# EAGLE design weblight_developer (EAGLE 7.5.0)
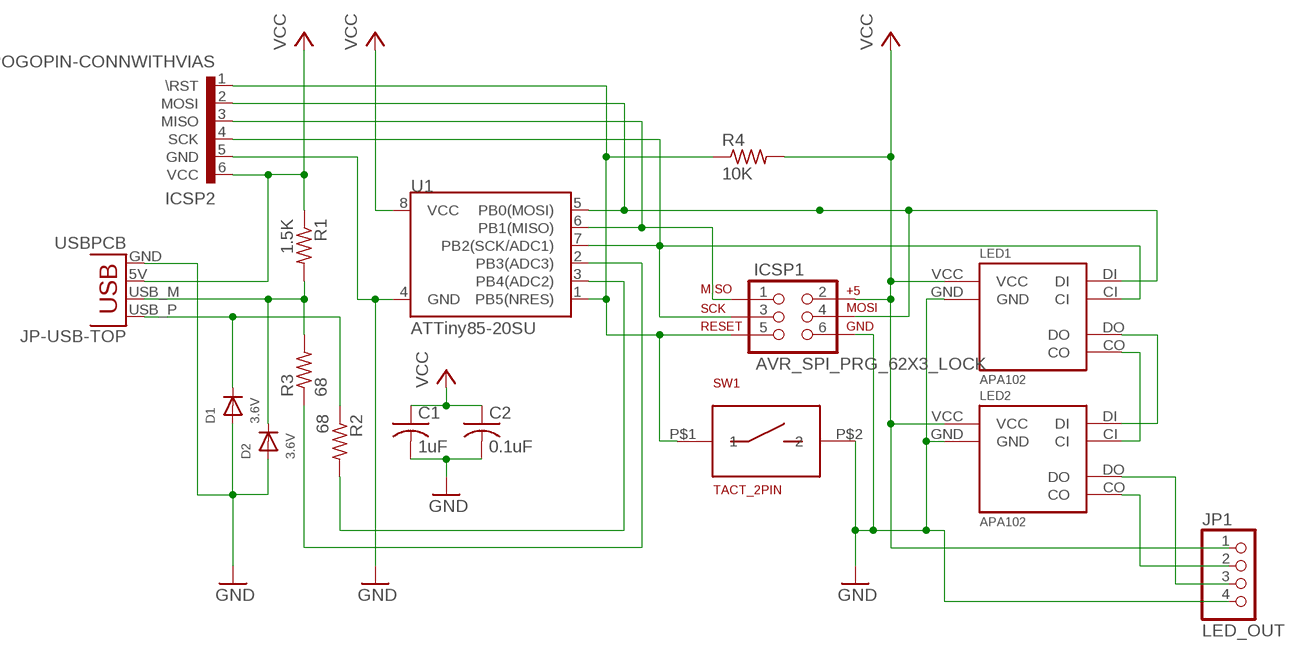
[diagram p0: schematic, sheet 1]

## Parts
C1  1uF  C-USC0805  [C0805]
C2  0.1uF  C-USC0805  [C0805]
D1  3.6V  DIODESOD-323  [SOD-323]
D2  3.6V  DIODESOD-323  [SOD-323]
ICSP1  AVR_SPI_PRG_62X3_LOCK  [2X3_LOCK]
ICSP2  POGOPIN-CONNWITHVIAS  [POGOPROG-CONN-0H]
JP1  LED_OUT  HEADER-1X4ROUND  [1X04_ROUND]
JP-USB-TOP  USBPCB  [USB-A-PCB]
LED1  APA102  [APA102]
LED2  APA102  [APA102]
R1  1.5K  R-US_R0805  [R0805]
R2  68  R-US_R0805  [R0805]
R3  68  R-US_R0805  [R0805]
R4  10K  R-US_R0805  [R0805]
SW1  TACT_2PIN  [TD-85XU]
U1  ATTiny85-20SU  ATTINY45TINY85-20-SMT  [SO08-EIAJ]

## Nets
CLK_1/SCK: ICSP1.3 ICSP2.4(SCK) LED1.CI U1.7(PB2(SCK/ADC1))
CLK_2: LED1.CO LED2.CI
CLK_3: JP1.2 LED2.CO
DATA_1/MOSI: ICSP1.4 ICSP2.2(MOSI) LED1.DI U1.5(PB0(MOSI))
DATA_2: LED1.DO LED2.DI
DATA_3: JP1.3 LED2.DO
GND: C1.2 C2.2 D1.A D2.A ICSP1.6 ICSP2.5(GND) JP1.4 JP-USB-TOP.GND LED1.GND LED2.GND SW1.P$2 U1.4(GND)
MISO: ICSP1.1 ICSP2.3(MISO) U1.6(PB1(MISO))
N_RESET: ICSP1.5 ICSP2.1(\RST) R4.1 SW1.P$1 U1.1(PB5(NRES))
USB_D_MINUS: R3.1 U1.2(PB3(ADC3))
USB_D_MINUS_RAW: D2.C JP-USB-TOP.USB_M(D-) R1.2 R3.2
USB_D_PLUS: R2.2 U1.3(PB4(ADC2))
USB_D_PLUS_RAW: D1.C JP-USB-TOP.USB_P(D+) R2.1
VCC: C1.1 C2.1 ICSP1.2 ICSP2.6(VCC) JP1.1 JP-USB-TOP.5V(VBUS) LED1.VCC LED2.VCC R1.1 R4.2 U1.8(VCC)

## Library data of the parts
C1 C2 = rcl:C-US: CAPACITOR, American symbol
D1 D2 = microbuilder:DIODE: Diode SMA Model Volts Amps Type Vf Vr Digikey # Notes SSA34-E3 40V 3A Schottky 480mV @ 3A 200uA @ 40V SSA34-E3/61TGITR-ND CDBA120-G 20V 1A Schottky 500mV @ 1A 500uA @ 20V 641-1014-6-ND REEL MBRA210 10V 2A Schottky 350mV @ 2A 700uA @ 10V MBRA210LT3 SOD-123 Model Volts Amps Type Vf Vr Order # Notes BAT54T1G 30V 200mA Schottky 800mV @ 200mA 2uA @ 25V BAT54T1GOSTR-ND B0530W 30V 500mA Schottky 430mV @ 500mA 130uA @ 30V B0530W-FDICT-ND REEL MBR120 1A 20V Schottky 340mV @ 1A MBR120VLSFT1GOSCT-ND SOD-323 Model Volts Amps Type Vf Vr Order # Notes PMEG2005EJ 20V 500mA Schottky 355mV @ 500mA 568-4110-1-ND ZLLS410 10V 570mA Schottky 380mV @ 570mA ZLLS410CT-ND 1N4148WS 75V 150mA Silicon/Simple 1V 1N4148WSFSCT-ND REEL SOD-523 Model Volts Amps Type Vf Vr Order # Notes BAT54XV2 30V 200mA Schottky 0.8V @ 100mA BAT54XV2CT-ND TB751S 30V 30mA Schottky RB751S-40TE61CT-ND SOT23-R/W (R = Solder Paste/Reflow Ovens, W = Hand-Soldering) Model Volts Amps Type Vf Vr Order # Notes BAT54FILM 40V 300mA Schottky 497-7162-1-ND
ICSP1 = SparkFun-Connectors:AVR_SPI_PRG_6: AVR ISP 6 Pin This is the reduced ISP connector for AVR programming. Common on Arduino. This footprint will take up less PCB space and can be used with a 10-pin to 6-pin adapter such as SKU: BOB-08508 **Special note about "TEST_POINT" package. The stop mask is on the top side, so if you want your programming test points to be on the bottom of your board, make sure to place this package on the bottom side of the board. This also ensure that the orientation to program from the bottom side will be correct.
ICSP2 = weblight:POGOPIN-CONN: Protofusion custom pogo pin programming header
JP1 = microbuilder:HEADER-1X4: PIN HEADER
JP-USB-TOP = SparkFun-Connectors:USB: USB Connectors USB-B-PTH is fully proven SKU : PRT-00139/CONN-08278 USB-miniB is fully proven SKU : PRT-00587 USB-A-PCB is untested. USB-A-H is throughly reviewed, but untested. Spark Fun Electronics SKU : PRT-00437 USB-B-SMT is throughly reviewed, but untested. Needs silkscreen touching up. USB-A-S has not been used/tested USB-MB-H has not been used/tested USB-MICROB has been used. CONN-09505
LED1 LED2 = weblight:APA102
R1-R4 = rcl:R-US_: RESISTOR, American symbol
SW1 = weblight:TACT_2PIN
U1 = SparkFun-DigitalIC:ATTINY45: Atmel 8-pin 2/4/8kB flash uC; PROD_ID: IC-09092; VALUE: Tiny85-20-SMT

## Board
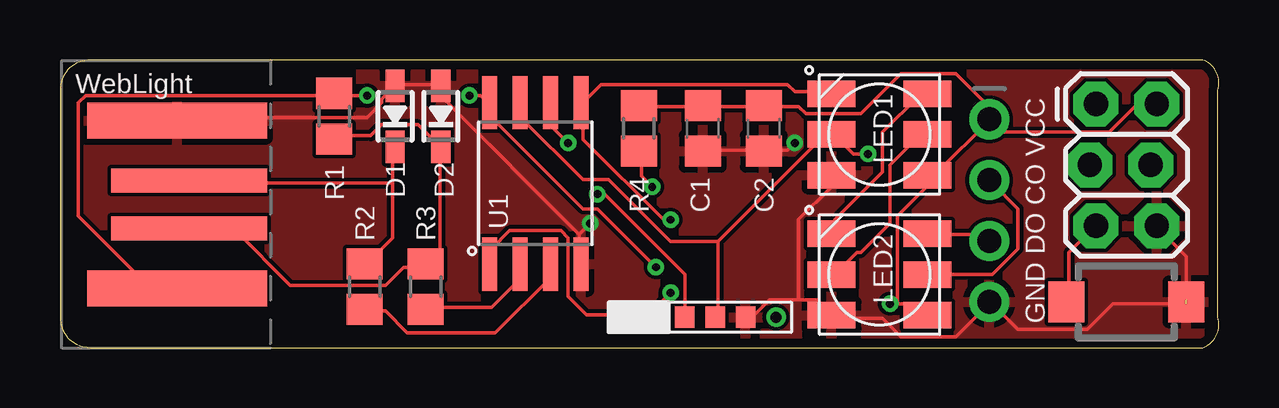
[diagram p1: board, top side]
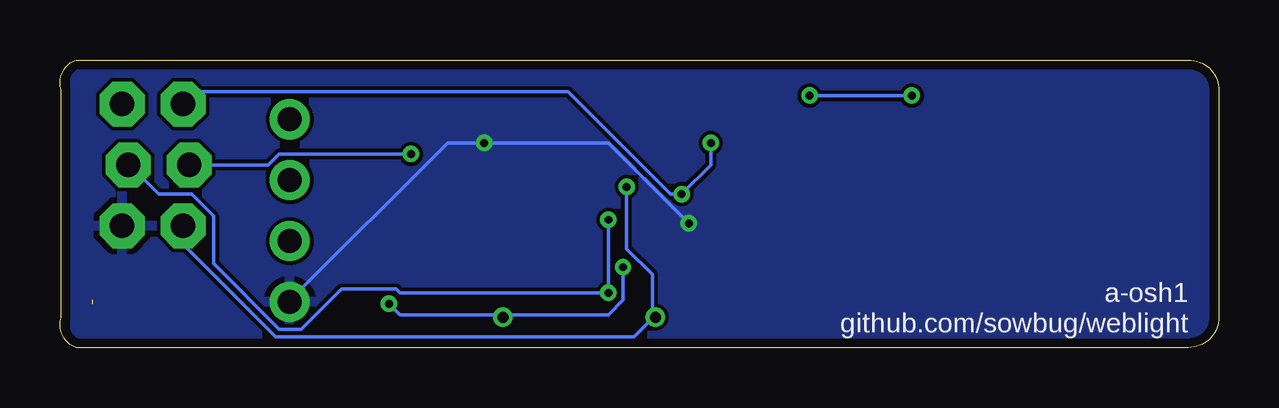
[diagram p2: board, bottom side, seen from below]

Size 48.31 x 12 mm. Coordinates in mm from the lower left corner, seen from the top.
Outline: 0,10.73 0,1.27 arc90 1.27,0 47.62,0 arc90 48.26,1.27 48.26,10.73 arc90 47.62,12 1.27,12 arc90 0,10.73
Copper layers (1*16): Top 0.0356mm / dielectric 1.5011mm / Bottom 0.0356mm
Design rules "LaenPCBOrder": minimum track width 6mil, minimum drill 13mil, track to track 6mil, track to pad 6mil, pad to pad 6mil, via to via 6mil, smd to smd 6mil, copper to edge 15mil, drill to drill 6mil, minimum pad ring 7mil, minimum via ring 7mil, stop-mask expansion 3mil, vias tented up to drill 0mil, thermal gap 10mil
vRestrict: area 0,0 to 9.5,12.1; area 1.3,0.6 to 19.1,2.5

### Footprints (pad centres in the part's own frame; a part is rotated, then mirrored left to right if it is on the bottom)
C0805 = smd 1.3 x 1.5: 1 -0.95,0; 2 0.95,0
SOD-323 = smd 1.35 x 0.8: A 1.27,0; C -1.27,0
2X3_LOCK = drill 1.016 pad 1.88 octagon: 1 0,0; 2 0,2.54; 3 2.54,-0.254; 4 2.54,2.286; 5 5.08,0; 6 5.08,2.54
POGOPROG-CONN-0H = drill 0.457: 1 0,3.81; 6 0,-2.54 | smd 0.889 x 0.813: 2 0,2.54; 3 0,1.27; 4 0,0; 5 0,-1.27
1X04_ROUND = drill 1 pad 1.676: 1 -3.81,0; 2 -1.27,0; 3 1.27,0; 4 3.81,0
USB-A-PCB = smd 7.5 x 1.5: 5V -0.2,-3.5; GND -0.2,3.5 | smd 6.5 x 1: USB_M 0.3,-1; USB_P 0.3,1
APA102 = smd 2 x 1.1: CI 2,0; CO -2,0; DI 2,-1.7; DO -2,-1.7; GND 2,1.7; VCC -2,1.7
R0805 = smd 1.3 x 1.5: 1 -0.95,0; 2 0.95,0
TD-85XU = smd 1.5 x 1.7: P$1 -2.5,0; P$2 2.5,0
SO08-EIAJ = smd 0.61 x 2.21: 1 -1.905,-3.378; 2 -0.635,-3.378; 3 0.635,-3.378; 4 1.905,-3.378; 5 1.905,3.353; 6 0.635,3.353; 7 -0.635,3.353; 8 -1.905,3.353

### Placement (x,y rotation side)
C1  26.8,9.14 270 top
C2  29.34,9.14 270 top
D1  13.97,9.65 90 top
D2  15.88,9.65 90 top
ICSP1  43.18,10.16 270 top
ICSP2  27.3,1.27 90 top
JP1  38.73,5.71 270 top
JP-USB-TOP  5.08,5.97 0 top
LED1  34.16,8.89 180 top
LED2  34.16,3.05 180 top
R1  11.43,9.65 270 top
R2  12.7,2.54 270 top
R3  15.24,2.54 90 top
R4  24.13,9.14 90 top
SW1  44.45,1.91 0 top
U1  19.81,6.86 0 top

### Tracks (layer width: path | path; a pad name or v marks a point on that pad's centre or on a via)
CLK_1/SCK  (via drill 0.33)
  Top 0.152: 27.43,4.42 27.43,1.37 ICSP2.4 | 27.43,4.42 31.85,8.84 32.16,8.84 LED1.CI 32.31,8.84 33.07,8.08 v33.68,8.08 | 27.43,4.42 25.45,4.42 22.86,7.01 21.79,7.01 19.2,9.6 19.2,10.21 U1.7
  Bottom 0.152: v33.68,8.08 39.17,8.08 39.62,7.62 42.82,7.62 ICSP1.3
CLK_2
  Top 0.152: LED2.CI 32.31,3.05 33.22,3.96 33.38,3.96 34.59,5.18 34.59,7.62 35.81,8.84 36.12,8.84 LED1.CO
CLK_3
  Top 0.152: LED2.CO 36.27,3.05 38.86,3.05 39.93,4.12 39.93,5.79 38.86,6.86 JP1.2
DATA_1/MOSI  (via drill 0.33)
  Top 0.152: 21.79,10.21 22.55,10.97 30.33,10.97 30.63,10.67 32.16,10.67 LED1.DI | 21.79,10.21 U1.5 21.79,10.21 | v25.45,2.29 24.84,1.68 24.84,1.37 ICSP2.2 | 21.79,10.21 21.79,8.69 25.15,5.33 v25.45,5.33
  Bottom 0.152: ICSP1.4 45.41,7.62 44.2,6.4 42.82,6.4 41.91,5.49 41.91,3.5 39.17,0.76 38.25,0.76 36.58,2.44 34.29,2.44 34.14,2.29 v25.45,2.29 v25.45,5.33
DATA_2
  Top 0.152: LED2.DI 32.31,4.88 32.31,5.33 34.29,7.32 34.29,8.99 35.81,10.52 36.12,10.52 LED1.DO
DATA_3
  Top 0.152: LED2.DO 36.27,4.72 38.56,4.72 38.71,4.57 JP1.3
GND  (via drill 0.33)  (2 unrouted)
  Top 0.152: 30.79,1.98 31.55,1.98 32.16,1.37 LED2.GND 32.31,1.22 34.29,1.22 35.05,0.46 37.34,0.46 38.71,1.83 JP1.4 38.86,1.83 39.93,0.76 42.82,0.76 43.89,1.83 46.94,1.83 | 30.79,1.98 29.57,1.98 28.96,1.37 28.65,1.37 ICSP2.5 | 30.79,1.98 30.79,5.33 32.16,6.71 32.16,7.16 LED1.GND | 46.94,1.98 46.94,3.81 45.72,5.03 ICSP1.6 | C1.2 26.82,8.23 29.26,8.23 C2.2 29.41,8.23 30.33,8.23 v30.63,8.53 | JP-USB-TOP.GND 5.03,9.6 12.8,9.6 13.41,10.21 13.41,10.36 13.87,10.82 D1.A 14.02,10.97 15.85,10.97 D2.A 16,10.82 16,10.36 21.64,4.72 | 21.64,4.72 21.64,3.5 U1.4 | 21.64,4.72 v22.1,5.18
  Bottom 0.152: JP1.4 38.71,1.98 32.16,8.53 v30.63,8.53 25.45,8.53 v22.1,5.18
  pour Bottom: -1.27,13.34 49.53,13.34 49.53,-1.27 -1.27,-1.27
  pour Top: -0.64,12.7 48.9,12.7 48.9,-0.64 -0.64,-0.64
MISO  (via drill 0.33)
  Top 0.152: v22.4,6.4 22.71,6.4 26.06,3.05 26.06,1.37 ICSP2.3 | v21.18,8.53 20.57,9.14 20.57,10.21 U1.6
  Bottom 0.152: ICSP1.1 43.13,10.21 42.67,10.67 27.13,10.67 22.86,6.4 v22.4,6.4 21.18,7.62 v21.18,8.53
N_RESET  (via drill 0.33)
  Top 0.152: SW1.P$1 42.06,1.98 42.06,3.96 43.13,5.03 ICSP1.5 | v24.69,6.71 24.23,7.16 24.23,8.08 R4.1 | U1.1 17.98,3.5 17.98,4.12 18.75,4.88 20.88,4.88 21.18,4.57 21.18,2.13 21.95,1.37 23.47,1.37 ICSP2.1
  Bottom 0.152: v24.69,6.71 24.69,4.12 23.62,3.05 23.62,1.37 ICSP2.1 23.62,1.22 24.38,0.46 39.32,0.46 43.13,4.27 43.13,5.03 ICSP1.5
USB_D_MINUS
  Top 0.152: R3.1 15.24,1.68 17.98,1.68 19.05,2.74 19.05,3.35 U1.2
USB_D_MINUS_RAW
  Top 0.152: 15.85,8.38 15.85,4.12 15.24,3.5 R3.2 15.24,3.35 14.33,3.35 13.56,2.59 9.6,2.59 7.32,4.88 5.49,4.88 JP-USB-TOP.USB_M | 15.85,8.38 D2.C 15.85,8.38 | 15.85,8.38 14.94,9.3 13.41,9.3 12.95,8.84 11.43,8.84 R1.2
USB_D_PLUS
  Top 0.152: R2.2 12.8,1.52 13.56,1.52 14.48,0.61 18.14,0.61 20.42,2.9 20.42,3.35 U1.3
USB_D_PLUS_RAW
  Top 0.152: 13.87,6.86 13.87,4.57 12.8,3.5 R2.1 | 13.87,6.86 13.87,8.38 D1.C | 13.87,6.86 5.49,6.86 JP-USB-TOP.USB_P
VCC  (via drill 0.33)
  Top 0.152: R4.2 24.23,10.06 26.67,10.06 C1.1 26.82,10.06 29.26,10.06 C2.1 29.41,10.06 30.79,10.06 31.09,9.75 33.38,9.75 35.05,11.43 37.34,11.43 38.71,10.06 38.71,9.6 JP1.1 | JP1.1 38.71,9.45 36.58,7.32 36.27,7.32 LED1.VCC 36.12,7.16 36.12,6.71 34.9,5.49 34.9,1.83 | ICSP1.2 45.72,10.06 44.81,10.06 43.74,8.99 39.32,8.99 38.86,9.45 JP1.1 | 11.43,10.52 1.07,10.52 0.76,10.21 0.76,5.49 3.66,2.59 4.88,2.59 JP-USB-TOP.5V | 11.43,10.52 R1.1 11.43,10.52 | 34.9,1.83 35.66,1.83 36.12,1.37 LED2.VCC | 34.9,1.83 v34.59,1.83 34.9,1.83 | v24.84,3.35 22.4,5.79 21.79,5.79 17.98,9.6 17.98,10.21 U1.8 17.83,10.21 17.53,10.52 v17.07,10.52 | v12.8,10.52 11.43,10.52
  Bottom 0.152: v34.59,1.83 34.14,1.37 29.87,1.37 ICSP2.6 29.72,1.37 25.45,1.37 24.84,1.98 v24.84,3.35 | v17.07,10.52 v12.8,10.52

### Text on the board
tPlace: WebLight | GND DO CO VCC
bPlace: a-osh1 | github.com/sowbug/weblight